# Altium project PCB_Project_1.PrjPcb
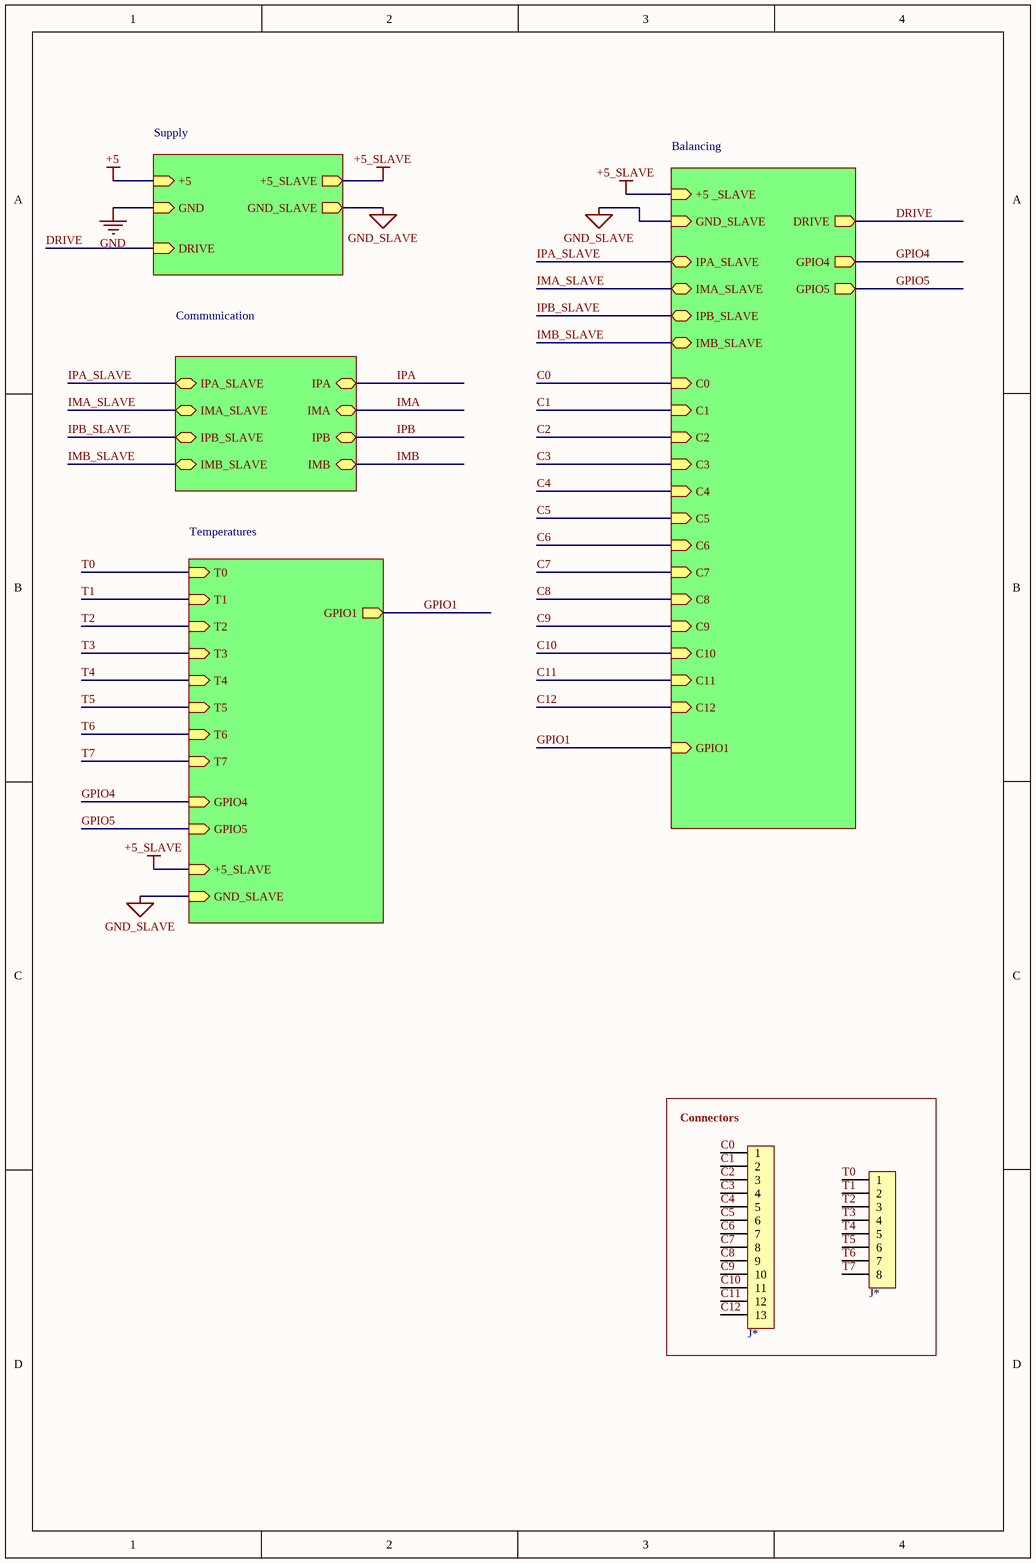
[diagram p0: Hierarchical Schematic.SchDoc]
3 sheets, 37 parts. Net scope: hierarchical (ports join the sheet entries above them; power ports are global).
Sheets:
  Hierarchical Schematic.SchDoc
    Supply = Supply.SchDoc
  Temperatures.SchDoc

## Sheet Hierarchical Schematic.SchDoc
size A4 portrait; SheetNumber: 1; SheetTotal: 3

### Parts
(Parts that share a designator on the sheet are numbered #1, #2 ... from top to bottom, then left to right.)
J*#1  61301211121  [J_Pinheader_1x13]  (value not drawn)
J*#2  61301211121  [J_Pinheader_1x8]  (value not drawn)

### Blocks framed on the sheet
Connectors: J*#1 J*#2

### Sub-sheets
Balancing = Balanciing (file not in this document): GND_SLAVE (in), +5 _SLAVE (in), IPA_SLAVE (bidir), IMA_SLAVE (bidir), IPB_SLAVE (bidir), IMB_SLAVE (bidir), DRIVE (out), GPIO1 (in), GPIO4 (out), GPIO5 (out), C0 (in), C1 (in), C2 (in), C3 (in), C4 (in), C5 (in), C6 (in), C7 (in), C8 (in), C9 (in), C10 (in), C11 (in), C12 (in)
Communication = File Name (file not in this document): IPA_SLAVE (bidir), IMA_SLAVE (bidir), IPB_SLAVE (bidir), IMB_SLAVE (bidir), IPA (bidir), IMA (bidir), IPB (bidir), IMB (bidir)
Supply = Supply: GND (in), +5 (in), GND_SLAVE (out), +5_SLAVE (out), DRIVE (in)
Temperatures = File Name (file not in this document): T0 (in), T2 (in), T3 (in), T4 (in), T6 (in), T7 (in), T5 (in), T1 (in), GPIO5 (in), GPIO4 (in), GPIO1 (out), +5_SLAVE (in), GND_SLAVE (in)

### Nets
+5_SLAVE: sheet Supply/+5_SLAVE, sheet Balancing/+5 _SLAVE, sheet Temperatures/+5_SLAVE
GND_SLAVE: sheet Supply/GND_SLAVE, sheet Balancing/GND_SLAVE, sheet Temperatures/GND_SLAVE
C0: J*#1.1 ; sheet Balancing/C0
C1: J*#1.2 ; sheet Balancing/C1
C2: J*#1.3 ; sheet Balancing/C2
C3: J*#1.4 ; sheet Balancing/C3
C4: J*#1.5 ; sheet Balancing/C4
C5: J*#1.6 ; sheet Balancing/C5
C6: J*#1.7 ; sheet Balancing/C6
C7: J*#1.8 ; sheet Balancing/C7
C8: J*#1.9 ; sheet Balancing/C8
C9: J*#1.10 ; sheet Balancing/C9
C10: J*#1.11 ; sheet Balancing/C10
C11: J*#1.12 ; sheet Balancing/C11
C12: J*#1.13 ; sheet Balancing/C12
DRIVE: sheet Supply/DRIVE, sheet Balancing/DRIVE
GPIO1: sheet Balancing/GPIO1, sheet Temperatures/GPIO1
GPIO4: sheet Balancing/GPIO4, sheet Temperatures/GPIO4
GPIO5: sheet Balancing/GPIO5, sheet Temperatures/GPIO5
IMA: sheet Communication/IMA
IMA_SLAVE: sheet Balancing/IMA_SLAVE, sheet Communication/IMA_SLAVE
IMB: sheet Communication/IMB
IMB_SLAVE: sheet Balancing/IMB_SLAVE, sheet Communication/IMB_SLAVE
IPA: sheet Communication/IPA
IPA_SLAVE: sheet Balancing/IPA_SLAVE, sheet Communication/IPA_SLAVE
IPB: sheet Communication/IPB
IPB_SLAVE: sheet Balancing/IPB_SLAVE, sheet Communication/IPB_SLAVE
T0: J*#2.1 ; sheet Temperatures/T0
T1: J*#2.2 ; sheet Temperatures/T1
T2: J*#2.3 ; sheet Temperatures/T2
T3: J*#2.4 ; sheet Temperatures/T3
T4: J*#2.5 ; sheet Temperatures/T4
T5: J*#2.6 ; sheet Temperatures/T5
T6: J*#2.7 ; sheet Temperatures/T6
T7: J*#2.8 ; sheet Temperatures/T7

### Library data of the parts
J*#1 = J_Pinheader_1x13: THT Vertical Pin Header WR-PHD, Pitch 2.54 mm, Single Row, 13 pins; Manufacturer 1: Wurth Electronics; Number of Positions: 12; Gender: Male; Connector Type: Male Pin; Pitch: 0.1inch; Supplier 1: Digi-Key; Manufacturer Part Number 1: 61301211121; RoHS: Yes; Category: Connectors; Stock 1: 2124; Pricing 1: 1=0,57000, 10=0,48400, 25=0,40400, 50=0,33700, 100=0,30600, 1000=0,27800 (USD); Mount: Through Hole; Contact Plating: Gold; Contact Material: Copper; Color: Black; Number of Rows: 1; Packaging: Bulk; Termination: Solder; Number of Contacts: 12; Contact Mating Length: 0.236inch; REACH SVHC: Unknown; RoHS Compliant: Yes; ComponentLink1URL: http://www.farnell.com/cad/1737268.pdf?src-supplier=Element14; ComponentLink1Description: http://www.farnell.com/cad/1737268.pdf?src-supplier=Element14; ComponentLink2URL: https://katalog.we-online.de/em/datasheet/6130xx11121.pdf?src-supplier=Digi-Key; ComponentLink2Description: https://katalog.we-online.de/em/datasheet/6130xx11121.pdf?src-supplier=Digi-Key
J*#2 = J_Pinheader_1x8: THT Vertical Pin Header WR-PHD, Pitch 2.54 mm, Single Row, 12 pins; Manufacturer 1: Wurth Electronics; Number of Positions: 12; Gender: Male; Connector Type: Male Pin; Pitch: 0.1inch; Supplier 1: Digi-Key; Manufacturer Part Number 1: 61301211121; RoHS: Yes; Category: Connectors; Stock 1: 2124; Pricing 1: 1=0,57000, 10=0,48400, 25=0,40400, 50=0,33700, 100=0,30600, 1000=0,27800 (USD); Mount: Through Hole; Contact Plating: Gold; Contact Material: Copper; Color: Black; Number of Rows: 1; Packaging: Bulk; Termination: Solder; Number of Contacts: 12; Contact Mating Length: 0.236inch; REACH SVHC: Unknown; RoHS Compliant: Yes; ComponentLink1URL: http://www.farnell.com/cad/1737268.pdf?src-supplier=Element14; ComponentLink1Description: http://www.farnell.com/cad/1737268.pdf?src-supplier=Element14; ComponentLink2URL: https://katalog.we-online.de/em/datasheet/6130xx11121.pdf?src-supplier=Digi-Key; ComponentLink2Description: https://katalog.we-online.de/em/datasheet/6130xx11121.pdf?src-supplier=Digi-Key

## Sheet Supply.SchDoc
size A4; SheetNumber: 2; SheetTotal: 4
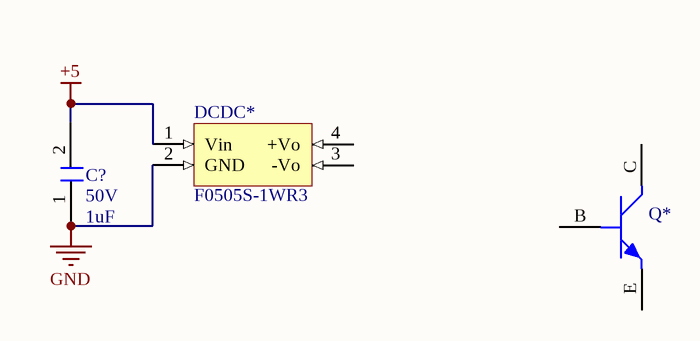
[diagram p1: Supply.SchDoc]

### Parts
(Parts that share a designator on the sheet are numbered #1, #2 ... from top to bottom, then left to right.)
C?#1  Voltage Rating: 50V  Capacitance: 1uF  [C0805FNPC-R]  (hidden comment: 885012207103)
DCDC*  F0505S-1WR3  [F_S-1WR3]
Q*  BC817-25LT1G  [TRT-NPN-0.5/45-SOT23]  (value not drawn)

### Nets
+5: C?#1.2 DCDC*.1(Vin)
GND: C?#1.1 DCDC*.2(GND)

Not connected (* = marked no-connect by the designer): DCDC* 3(-Vo) 4(+Vo); Q* B C E

### Library data of the parts
C?#1 = C1u-50V-0805FNPC-X7R: Multilayer Ceramic Capacitor, Wcap-Csgp Series, 1 F, 10%, X7R, 50 V, 0805 [2012 Metric] Rohs Compliant: Yes; Manufacturer 1: Wurth Electronics; .Creator: GP; Supplier 1: RSComponents; Manufacturer Part Number 1: 885012207103; RoHS: Yes; Category: Ceramic Capacitors; Stock 1: 5100; Pricing 1: 50=0,27200, 250=0,25300, 500=0,22800, 1250=0,20100, 2500=0,17100 (GBP); Mount: Surface Mount; Case/Package: 0805; Case Code (Metric): 2012; Case Code (Imperial): 0805; Min Operating Temperature: -55°C; Max Operating Temperature: 85°C; Packaging: Cut Tape; Dielectric: X7R; Tolerance: 10%; Voltage Rating (DC): 50V; Length: 0.079inch; Width: 0.049inch; Thickness: 0.053inch; REACH SVHC: Unknown; RoHS Compliant: Yes; ComponentLink1URL: http://www.farnell.com/datasheets/1958501.pdf?src-supplier=Farnell; ComponentLink1Description: http://www.farnell.com/datasheets/1958501.pdf?src-supplier=Farnell; ComponentLink2URL: http://www.farnell.com/datasheets/1958501.pdf?src-supplier=Element14; ComponentLink2Description: http://www.farnell.com/datasheets/1958501.pdf?src-supplier=Element14; ComponentLink3URL: https://katalog.we-online.de/pbs/datasheet/885012107003.pdf?src-supplier=Digi-Key; ComponentLink3Description: https://katalog.we-online.de/pbs/datasheet/885012107003.pdf?src-supplier=Digi-Key; ComponentLink4URL: http://www.farnell.com/datasheets/1958501.pdf?src-supplier=Newark; ComponentLink4Description: http://www.farnell.com/datasheets/1958501.pdf?src-supplier=Newark; Supplier Part Number 1: 1813523
DCDC* = DCDC-5V/5V-0.2A
Q* = TRT-NPN-0.5/45-SOT23: ON Semi BC817-25LT1G NPN Bipolar Transistor; 0.5 A; 45 V; 3-Pin SOT-23; Collector Emitter Voltage (VCEO): 45V; Max Collector Current: 500mA; Collector Base Voltage (VCBO): 50V; Power Dissipation: 300mW; hFE Min: 160; Transition Frequency: 100MHz; Emitter Base Voltage (VEBO): 5V; Element Configuration: Single; Collector-emitter Voltage-Max: 700mV; Number of Elements: 1; .Creator: GP; Category: Transistor; ComponentLink1Description: Datasheet; ComponentLink1URL: *; ComponentLink2Description: Where buy it; ComponentLink2URL: *; Package: *; Type: *; Manufacturer: *; Manufacturer part number: *; Supplier: *; Packaging: *; Max operating temperature: *; Min operating temperature: *; Max power dissipation: *; Power rating: *; RoHS: *; Polarity: *; Vce max: *; Ic max: *; Gain: *; Supplier 1: Digi-Key; Pricing 1: 1=0,20000, 10=0,18500, 100=0,10080, 500=0,06204, 1000=0,04229 (USD); Case/Package: SOT-23-3; Number of Pins: 3; Contact Plating: Tin,Matte; Package Quantity: 1; Collector Emitter Breakdown Voltage: 45V; Max Breakdown Voltage: 45V; Max Frequency: 100MHz; Current Rating: 500mA; Series: -; Frequency: 100MHz; Collector Emitter Saturation Voltage: 700mV; Gain Bandwidth Product: 100MHz; Length: 2.9mm; Width: 1.3mm; Height: 0.94mm; Radiation Hardening: No; Lead Free: Lead Free; Halogen Free: Halogen Free; RoHS Compliant: Yes; REACH SVHC: No SVHC; ComponentLink3URL: https://datasheet.ciiva.com/27748/2010413-27748829.pdf?src-supplier=Jameco; ComponentLink3Description: https://datasheet.ciiva.com/27748/2010413-27748829.pdf?src-supplier=Jameco; ComponentLink4URL: https://datasheet.ciiva.com/15138/getdatasheetpartid-38405-15138602.pdf?src-supplier=Verical; ComponentLink4Description: https://datasheet.ciiva.com/15138/getdatasheetpartid-38405-15138602.pdf?src-supplier=Verical; ComponentLink5URL: https://datasheet.ciiva.com/1196/bc817-16lt1-d-1196558.pdf?src-supplier=Element14; ComponentLink5Description: https://datasheet.ciiva.com/1196/bc817-16lt1-d-1196558.pdf?src-supplier=Element14; ComponentLink6URL: https://datasheet.ciiva.com/22641/bc817-16lt1-d-22641013.pdf?src-supplier=Farnell; ComponentLink6Description: https://datasheet.ciiva.com/22641/bc817-16lt1-d-22641013.pdf?src-supplier=Farnell; ComponentLink7URL: https://datasheet.ciiva.com/22664/bc817-16lt1-d-22664204.pdf?src-supplier=Element14; ComponentLink7Description: https://datasheet.ciiva.com/22664/bc817-16lt1-d-22664204.pdf?src-supplier=Element14; ComponentLink8URL: https://datasheet.ciiva.com/22664/1842041-22664101.pdf?src-supplier=Element14; ComponentLink8Description: https://datasheet.ciiva.com/22664/1842041-22664101.pdf?src-supplier=Element14; ComponentLink9URL: https://datasheet.ciiva.com/4722/bc817-16lt1-d-104560-4722229.pdf?src-supplier=Mouser; ComponentLink9Description: https://datasheet.ciiva.com/4722/bc817-16lt1-d-104560-4722229.pdf?src-supplier=Mouser; ComponentLink10URL: https://datasheet.ciiva.com/1195/bc817-16lt1-d-1195763.pdf?src-supplier=Element14; ComponentLink10Description: https://datasheet.ciiva.com/1195/bc817-16lt1-d-1195763.pdf?src-supplier=Element14; ComponentLink11URL: https://datasheet.ciiva.com/1195/bc817-16lt1-d-1195764.pdf?src-supplier=Element14; ComponentLink11Description: https://datasheet.ciiva.com/1195/bc817-16lt1-d-1195764.pdf?src-supplier=Element14; ComponentLink12URL: https://datasheet.ciiva.com/11197/bc817-16lt1-d-11197514.pdf?src-supplier=Avnet; ComponentLink12Description: https://datasheet.ciiva.com/11197/bc817-16lt1-d-11197514.pdf?src-supplier=Avnet; ComponentLink13URL: https://datasheet.ciiva.com/25996/bc817-16lt1-d-25996327.pdf?src-supplier=Avnet+Europe; ComponentLink13Description: https://datasheet.ciiva.com/25996/bc817-16lt1-d-25996327.pdf?src-supplier=Avnet+Europe; ComponentLink14URL: https://datasheet.ciiva.com/976/bc817-16lt1-d-976357.pdf?src-supplier=Digi-Key; ComponentLink14Description: https://datasheet.ciiva.com/976/bc817-16lt1-d-976357.pdf?src-supplier=Digi-Key; ComponentLink15URL: https://datasheet.ciiva.com/976/bc817-16lt1-d-976358.pdf?src-supplier=Digi-Key; ComponentLink15Description: https://datasheet.ciiva.com/976/bc817-16lt1-d-976358.pdf?src-supplier=Digi-Key; ComponentLink16URL: https://datasheet.ciiva.com/976/bc817-16lt1-d-976356.pdf?src-supplier=Digi-Key; ComponentLink16Description: https://datasheet.ciiva.com/976/bc817-16lt1-d-976356.pdf?src-supplier=Digi-Key; Supplier Part Number 1: BC817-25LT1GOSCT-ND

## Sheet Temperatures.SchDoc
size A4; SheetNumber: 3; SheetTotal: 3
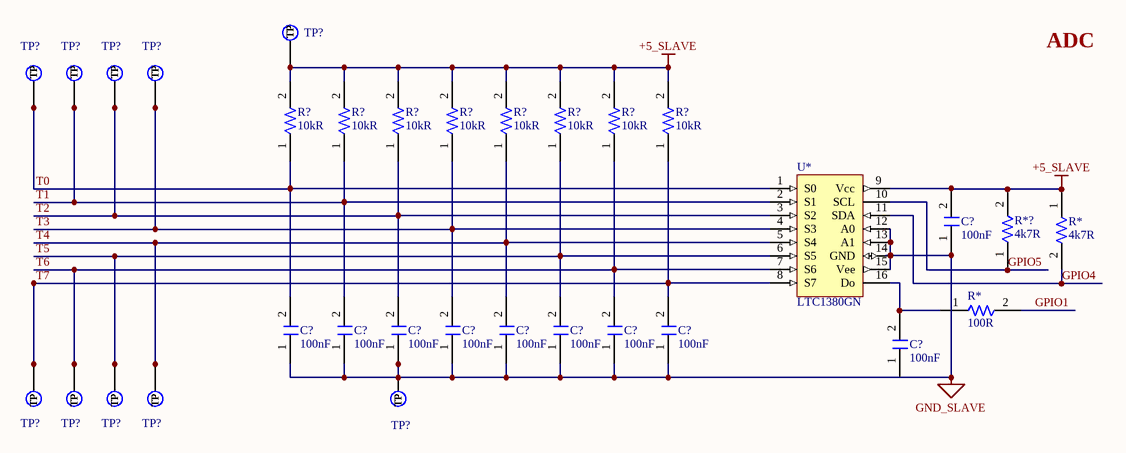
[diagram p2: Temperatures.SchDoc]

### Parts
(Parts that share a designator on the sheet are numbered #1, #2 ... from top to bottom, then left to right.)
C?#2  Capacitance: 100nF  [C0805FNPC-R]  (hidden comment: 885012207098)
C?#3  Capacitance: 100nF  [C0805FNPC-R]  (hidden comment: 885012207098)
C?#4  Capacitance: 100nF  [C0805FNPC-R]  (hidden comment: 885012207098)
C?#5  Capacitance: 100nF  [C0805FNPC-R]  (hidden comment: 885012207098)
C?#6  Capacitance: 100nF  [C0805FNPC-R]  (hidden comment: 885012207098)
C?#7  Capacitance: 100nF  [C0805FNPC-R]  (hidden comment: 885012207098)
C?#8  Capacitance: 100nF  [C0805FNPC-R]  (hidden comment: 885012207098)
C?#9  Capacitance: 100nF  [C0805FNPC-R]  (hidden comment: 885012207098)
C?#10  Capacitance: 100nF  [C0805FNPC-R]  (hidden comment: 885012207098)
C?#11  Capacitance: 100nF  [C0805FNPC-R]  (hidden comment: 885012207098)
R*#1  Resistance: 4k7R  [R0805FTK]  (hidden comment: CR0805-JW-472ELF)
R*#2  Resistance: 100R  [R0805FTK]  (hidden comment: CR0805-FX-1000ELF)
R*?  Resistance: 4k7R  [R0805FTK]  (hidden comment: CR0805-JW-472ELF)
R?#1  Resistance: 10kR  [R0805FTK]  (hidden comment: CR0805-JW-103ELF)
R?#2  Resistance: 10kR  [R0805FTK]  (hidden comment: CR0805-JW-103ELF)
R?#3  Resistance: 10kR  [R0805FTK]  (hidden comment: CR0805-JW-103ELF)
R?#4  Resistance: 10kR  [R0805FTK]  (hidden comment: CR0805-JW-103ELF)
R?#5  Resistance: 10kR  [R0805FTK]  (hidden comment: CR0805-JW-103ELF)
R?#6  Resistance: 10kR  [R0805FTK]  (hidden comment: CR0805-JW-103ELF)
R?#7  Resistance: 10kR  [R0805FTK]  (hidden comment: CR0805-JW-103ELF)
R?#8  Resistance: 10kR  [R0805FTK]  (hidden comment: CR0805-JW-103ELF)
TP?#1  TestPoint  [TestPoint]  (value not drawn)  (no BOM)
TP?#2  TestPoint  [TestPoint]  (value not drawn)  (no BOM)
TP?#3  TestPoint  [TestPoint]  (value not drawn)  (no BOM)
TP?#4  TestPoint  [TestPoint]  (value not drawn)  (no BOM)
TP?#5  TestPoint  [TestPoint]  (value not drawn)  (no BOM)
TP?#6  TestPoint  [TestPoint]  (value not drawn)  (no BOM)
TP?#7  TestPoint  [TestPoint]  (value not drawn)  (no BOM)
TP?#8  TestPoint  [TestPoint]  (value not drawn)  (no BOM)
TP?#9  TestPoint  [TestPoint]  (value not drawn)  (no BOM)
TP?#10  TestPoint  [TestPoint]  (value not drawn)  (no BOM)
U*  LTC1380GN  [LTC1380GN]

### Nets
+5_SLAVE: C?#2.2 R*#1.1 R*?.2 R?#1.2 R?#2.2 R?#3.2 R?#4.2 R?#5.2 R?#6.2 R?#7.2 R?#8.2 TP?#1.1(TP) U*.9(Vcc)
GND_SLAVE: C?#2.1 C?#3.1 C?#4.1 C?#5.1 C?#6.1 C?#7.1 C?#8.1 C?#9.1 C?#10.1 C?#11.1 TP?#10.1(TP) U*.12(A0) U*.13(A1) U*.14(GND) U*.15(Vee)
GPIO1: R*#2.2
GPIO4: R*#1.2 U*.11(SDA)
GPIO5: R*?.1 U*.10(SCL)
T0: C?#3.2 R?#1.1 TP?#2.1(TP) U*.1(S0)
T1: C?#4.2 R?#2.1 TP?#3.1(TP) U*.2(S1)
T2: C?#5.2 R?#3.1 TP?#4.1(TP) U*.3(S2)
T3: C?#6.2 R?#4.1 TP?#5.1(TP) U*.4(S3)
T4: C?#7.2 R?#5.1 TP?#9.1(TP) U*.5(S4)
T5: C?#8.2 R?#6.1 TP?#8.1(TP) U*.6(S5)
T6: C?#9.2 R?#7.1 TP?#7.1(TP) U*.7(S6)
T7: C?#10.2 R?#8.1 TP?#6.1(TP) U*.8(S7)
NetC?#11_2: C?#11.2 R*#2.1 U*.16(Do)

### Notes on the sheet
- ADC

### Library data of the parts
C?#2-C?#11 = C100n-50V-0805FNPC-X7R: Cap, 0.1ΜF, 50V, 10%, X7R, 0805; Manufacturer 1: Wurth Electronics; .Creator: DR; Supplier 1: RSComponents; Manufacturer Part Number 1: 885012207098; RoHS: Yes; Category: Ceramic Capacitors; Stock 1: 8000; Pricing 1: 100=0,10200, 500=0,07100, 2000=0,06100 (GBP); Mount: Surface Mount; Case/Package: 0805; Case Code (Metric): 2012; Case Code (Imperial): 0805; Min Operating Temperature: -55°C; Max Operating Temperature: 125°C; Packaging: Cut Tape; Voltage Rating: 50V; Dielectric: X7R; Tolerance: 10%; Voltage Rating (DC): 50V; Length: 0.079inch; Width: 0.049inch; Thickness: 0.035inch; REACH SVHC: Unknown; RoHS Compliant: Yes; ComponentLink1URL: http://www.farnell.com/datasheets/1958498.pdf?src-supplier=Farnell; ComponentLink1Description: http://www.farnell.com/datasheets/1958498.pdf?src-supplier=Farnell; ComponentLink2URL: http://www.farnell.com/datasheets/1958498.pdf?src-supplier=Element14; ComponentLink2Description: http://www.farnell.com/datasheets/1958498.pdf?src-supplier=Element14; ComponentLink3URL: https://katalog.we-online.de/pbs/datasheet/885012207098.pdf?src-supplier=Digi-Key; ComponentLink3Description: https://katalog.we-online.de/pbs/datasheet/885012207098.pdf?src-supplier=Digi-Key; ComponentLink4URL: http://www.farnell.com/datasheets/1958498.pdf?src-supplier=Newark; ComponentLink4Description: http://www.farnell.com/datasheets/1958498.pdf?src-supplier=Newark; Supplier Part Number 1: 1813493
R*#1 R*? = R4.7K-0805FTK: Res Thick Film 0805 4.7K Ohm 5% 1/8W ±200ppm/°C Molded SMD SMD Paper Tape on Plastic Reel; Manufacturer 1: Bourns; Power Rating: 125mW; Voltage Rating: 150V; .Creator: DR; Supplier 1: Arrow Electronics; Manufacturer Part Number 1: CR0805-JW-472ELF; RoHS: Yes; Category: Chip SMD Resistors; Stock 1: 3734; Pricing 1: 1=0,05590, 10=0,01670, 25=0,01290, 100=0,00840, 250=0,00830, 500=0,00690, 1000=0,00410 (USD); Mount: Surface Mount; Case/Package: 0805; Case Code (Metric): 2012; Case Code (Imperial): 0805; Contact Plating: Tin; Min Operating Temperature: -55°C; Max Operating Temperature: 155°C; Packaging: Tape and Reel; Tolerance: 5%; Package Quantity: 1; Resistor Type: Thick Film; Number of Terminations: 2; Termination: SMD/SMT; Temperature Coefficient: 200ppm/°C; Max Power Dissipation: 125mW; Voltage Rating (DC): 150V; Features: Moisture Resistant; Series: CR0805; Resistance Tolerance: 5%; Construction: Rectangular; Length: 2mm; Width: 0.049inch; Height: 0.024inch; Depth: 1.25mm; Thickness: 508um; Radiation Hardening: No; REACH SVHC: No SVHC; Military Standard: Not; RoHS Compliant: Yes; ComponentLink1URL: https://datasheet.ciiva.com/5541/chpreztr-5541593.pdf?src-supplier=Mouser; ComponentLink1Description: https://datasheet.ciiva.com/5541/chpreztr-5541593.pdf?src-supplier=Mouser; ComponentLink2URL: https://datasheet.ciiva.com/6560/chpreztr-6560073.pdf?src-supplier=Digi-Key; ComponentLink2Description: https://datasheet.ciiva.com/6560/chpreztr-6560073.pdf?src-supplier=Digi-Key; ComponentLink3URL: https://datasheet.ciiva.com/6560/chpreztr-6560074.pdf?src-supplier=Digi-Key; ComponentLink3Description: https://datasheet.ciiva.com/6560/chpreztr-6560074.pdf?src-supplier=Digi-Key; ComponentLink4URL: https://datasheet.ciiva.com/30174/159chpreztr-30174252.pdf?src-supplier=Onlinecomponents.com; ComponentLink4Description: https://datasheet.ciiva.com/30174/159chpreztr-30174252.pdf?src-supplier=Onlinecomponents.com; ComponentLink5URL: https://datasheet.ciiva.com/9122/chpreztr-9122814.pdf?src-supplier=Avnet; ComponentLink5Description: https://datasheet.ciiva.com/9122/chpreztr-9122814.pdf?src-supplier=Avnet; ComponentLink6URL: https://datasheet.ciiva.com/22713/691949-22713272.pdf?src-supplier=Element14; ComponentLink6Description: https://datasheet.ciiva.com/22713/691949-22713272.pdf?src-supplier=Element14; ComponentLink7URL: https://datasheet.ciiva.com/6560/chpreztr-6560075.pdf?src-supplier=Digi-Key; ComponentLink7Description: https://datasheet.ciiva.com/6560/chpreztr-6560075.pdf?src-supplier=Digi-Key; Supplier Part Number 1: CR0805-JW-472ELF
R*#2 = R100-0805FTK: Res Thick Film 0805 100 Ohm 1% 1/8W ±100ppm/°C Molded SMD SMD Paper Tape on Plastic Reel; Manufacturer 1: Bourns; Power Rating: 125mW; Voltage Rating: 150V; .Creator: DR; Supplier 1: Arrow Electronics; Manufacturer Part Number 1: CR0805-FX-1000ELF; RoHS: Yes; Category: Chip SMD Resistors; Stock 1: 49802; Pricing 1: 1=0,05840, 10=0,03430, 25=0,01780, 100=0,00750, 250=0,00560, 500=0,00490, 3000=0,00470 (USD); Mount: Surface Mount; Case/Package: 0805; Number of Pins: 2; Contact Plating: Tin; Case Code (Imperial): 0805; Case Code (Metric): 2012; Min Operating Temperature: -55°C; Max Operating Temperature: 155°C; Tolerance: 1%; Resistor Type: Thick Film; Temperature Coefficient: 100ppm/°C; Packaging: Tape and Reel; Package Quantity: 1; Termination: SMD/SMT; Number of Terminations: 2; Max Power Dissipation: 125mW; Voltage Rating (DC): 150V; Features: Moisture Resistant; Series: CR0805; Resistance Tolerance: 1%; Construction: Rectangular; Technology: THICK FILM; Length: 2mm; Width: 1.25mm; Height: 0.5mm; Depth: 1.25mm; Thickness: 508um; Radiation Hardening: No; REACH SVHC: No SVHC; Military Standard: Not; RoHS Compliant: Yes; ComponentLink1URL: https://datasheet.ciiva.com/11809/0900766b80fcdb72-11809178.pdf?src-supplier=RSComponents; ComponentLink1Description: https://datasheet.ciiva.com/11809/0900766b80fcdb72-11809178.pdf?src-supplier=RSComponents; ComponentLink2URL: https://datasheet.ciiva.com/6547/chpreztr-6547413.pdf?src-supplier=Digi-Key; ComponentLink2Description: https://datasheet.ciiva.com/6547/chpreztr-6547413.pdf?src-supplier=Digi-Key; ComponentLink3URL: https://datasheet.ciiva.com/6547/chpreztr-6547414.pdf?src-supplier=Digi-Key; ComponentLink3Description: https://datasheet.ciiva.com/6547/chpreztr-6547414.pdf?src-supplier=Digi-Key; ComponentLink4URL: https://datasheet.ciiva.com/6547/chpreztr-6547415.pdf?src-supplier=Digi-Key; ComponentLink4Description: https://datasheet.ciiva.com/6547/chpreztr-6547415.pdf?src-supplier=Digi-Key; ComponentLink5URL: https://datasheet.ciiva.com/9120/chpreztr-9120744.pdf?src-supplier=Avnet; ComponentLink5Description: https://datasheet.ciiva.com/9120/chpreztr-9120744.pdf?src-supplier=Avnet; Supplier Part Number 1: CR0805-FX-1000ELF
R?#1-R?#8 = R10k-0805FTK: BOURNS         CR0805-JW-103ELF            Surface Mount Chip Resistor, Thick Film, CR Series, 10 kohm, 125 mW,  5%, 150 V; Temperature Coefficient: 200ppm/°C; Power Rating: 125mW; Voltage Rating: 150V; Voltage Rating (DC): 100V; .Creator: DR; Supplier 1: Arrow Electronics; Manufacturer 1: Bourns; Manufacturer Part Number 1: CR0805-JW-103ELF; RoHS: Yes; Category: Chip SMD Resistors; Stock 1: 57566; Pricing 1: 1=0,05790, 10=0,01540, 25=0,01340, 100=0,00340 (USD); Mount: Surface Mount; Case/Package: 0805; Number of Pins: 2; Contact Plating: Tin; Case Code (Metric): 2012; Case Code (Imperial): 0805; Min Operating Temperature: -55°C; Max Operating Temperature: 155°C; Tolerance: 5%; Resistor Type: Thick Film; Package Quantity: 1; Packaging: Tape and Reel; Number of Terminations: 2; Termination: SMD/SMT; Max Power Dissipation: 125mW; Features: Moisture Resistant; Series: CR0805; Construction: Rectangular; Resistance Tolerance: 5%; Technology: THICK FILM; Length: 2mm; Width: 1.25mm; Height: 0.5mm; Depth: 1.25mm; Thickness: 508um; Radiation Hardening: No; REACH SVHC: No SVHC; Military Standard: Not; RoHS Compliant: Yes; ComponentLink1URL: https://datasheet.ciiva.com/11821/0900766b80fcdb72-11821135.pdf?src-supplier=RSComponents; ComponentLink1Description: https://datasheet.ciiva.com/11821/0900766b80fcdb72-11821135.pdf?src-supplier=RSComponents; ComponentLink2URL: https://datasheet.ciiva.com/9122/chpreztr-9122374.pdf?src-supplier=Avnet; ComponentLink2Description: https://datasheet.ciiva.com/9122/chpreztr-9122374.pdf?src-supplier=Avnet; ComponentLink3URL: https://datasheet.ciiva.com/22693/1902866-22693254.pdf?src-supplier=Element14; ComponentLink3Description: https://datasheet.ciiva.com/22693/1902866-22693254.pdf?src-supplier=Element14; ComponentLink4URL: https://datasheet.ciiva.com/7986/691949-7986187.pdf?src-supplier=Element14; ComponentLink4Description: https://datasheet.ciiva.com/7986/691949-7986187.pdf?src-supplier=Element14; ComponentLink5URL: https://datasheet.ciiva.com/30065/159chpreztr-30065976.pdf?src-supplier=Onlinecomponents.com; ComponentLink5Description: https://datasheet.ciiva.com/30065/159chpreztr-30065976.pdf?src-supplier=Onlinecomponents.com; ComponentLink6URL: https://datasheet.ciiva.com/16783/70154685-16783482.pdf?src-supplier=Allied+Electronics; ComponentLink6Description: https://datasheet.ciiva.com/16783/70154685-16783482.pdf?src-supplier=Allied+Electronics; ComponentLink7URL: https://datasheet.ciiva.com/5548/chpreztr-5548491.pdf?src-supplier=Mouser; ComponentLink7Description: https://datasheet.ciiva.com/5548/chpreztr-5548491.pdf?src-supplier=Mouser; ComponentLink8URL: https://datasheet.ciiva.com/6559/chpreztr-6559900.pdf?src-supplier=Digi-Key; ComponentLink8Description: https://datasheet.ciiva.com/6559/chpreztr-6559900.pdf?src-supplier=Digi-Key; ComponentLink9URL: https://datasheet.ciiva.com/6559/chpreztr-6559901.pdf?src-supplier=Digi-Key; ComponentLink9Description: https://datasheet.ciiva.com/6559/chpreztr-6559901.pdf?src-supplier=Digi-Key; ComponentLink10URL: https://datasheet.ciiva.com/7985/1856384-7985869.pdf?src-supplier=Element14; ComponentLink10Description: https://datasheet.ciiva.com/7985/1856384-7985869.pdf?src-supplier=Element14; ComponentLink11URL: https://datasheet.ciiva.com/48692/001055517-da-01-en-smd-wid-cr0805-jw-103elf-10k-ohm-1-8w-48692118.pdf?src-supplier=Conrad; ComponentLink11Description: https://datasheet.ciiva.com/48692/001055517-da-01-en-smd-wid-cr0805-jw-103elf-10k-ohm-1-8w-48692118.pdf?src-supplier=Conrad; Supplier Part Number 1: CR0805-JW-103ELF
TP?#1-TP?#10 = TestPoint: Test Point 1x1 mm; .Creator: GP; Category: TestPoint; .PCBcheck: GP; .SCHcheck: GP
U* = U_LTC1380GN